# EAGLE design KGM 9DOF v1.0 (EAGLE 5.11)
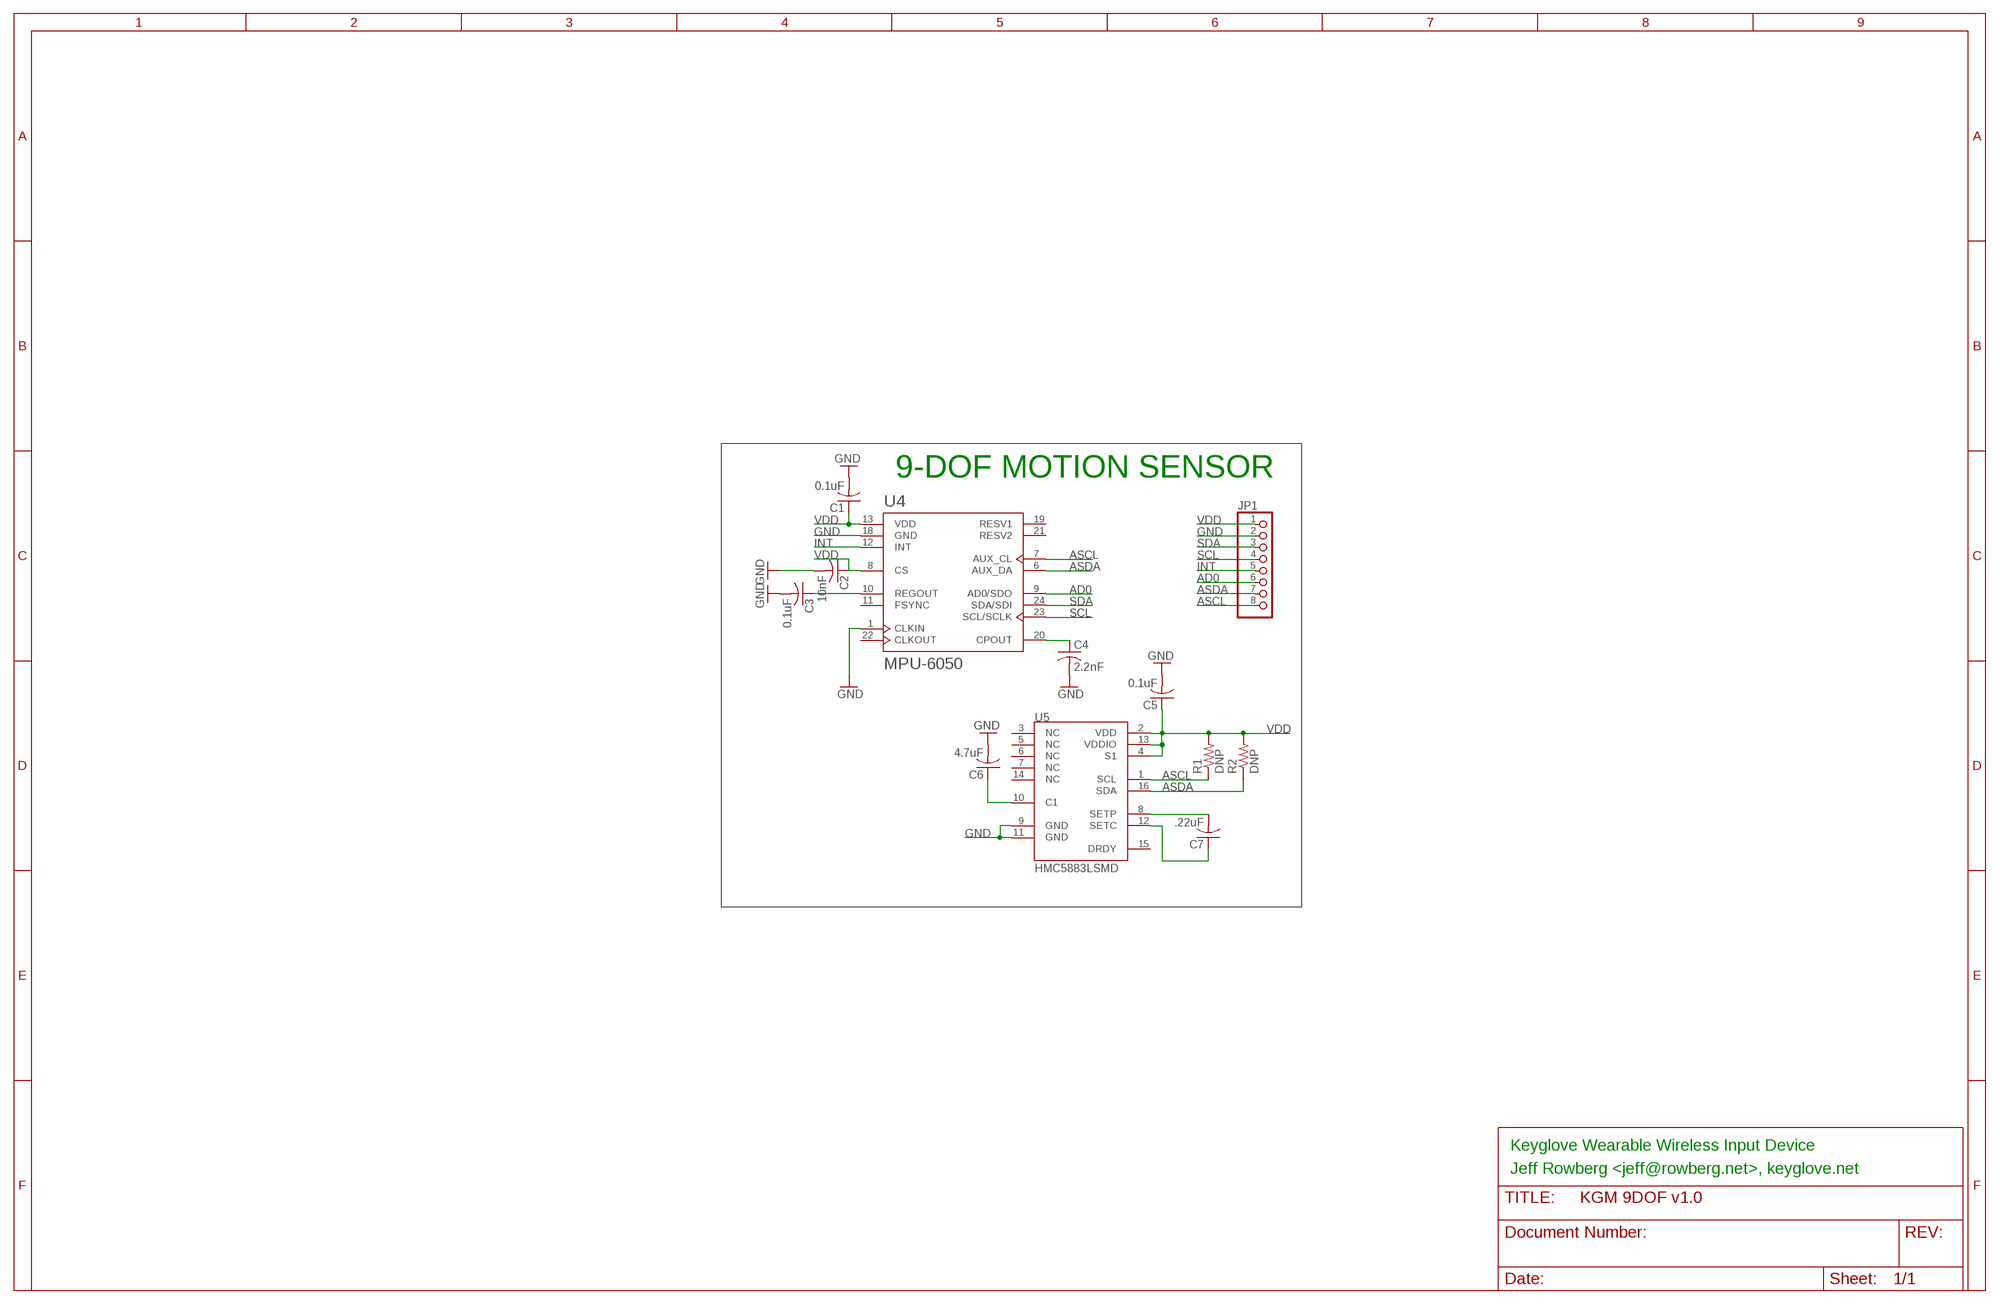
[diagram p0: schematic, sheet 1]

## Parts
C1  0.1uF  C-USC0603  [C0603]
C2  10nF  C-USC0603  [C0603]
C3  0.1uF  C-USC0603  [C0603]
C4  2.2nF  C-USC0603  [C0603]
C5  0.1uF  C-USC0603  [C0603]
C6  4.7uF  C-USC0603  [C0603]
C7  .22uF  C-USC0603  [C0603]
JP1  PINHD-1X8  [1X08]
R1  DNP  R-US_R0603  [R0603]
R2  DNP  R-US_R0603  [R0603]
U4  MPU-6050  MPU-6000  [QFN24MPU]
U5  HMC5883LSMD  [16LPCC]

## Nets
AD0: JP1.6 U4.9(AD0/SDO)
ASCL: JP1.8 R1.1 U4.7(AUX_CL) U5.1(SCL)
ASDA: JP1.7 R2.1 U4.6(AUX_DA) U5.16(SDA)
GND [power]: C1.2 C2.2 C3.2 C4.2 C5.2 C6.2 JP1.2 U4.1(CLKIN) U4.18(GND) U5.9(GND) U5.11(GND)
INT: JP1.5 U4.12(INT)
N$1: C6.1 U5.10(C1)
N$7: C7.2 U5.8(SETP)
N$10: C7.1 U5.12(SETC)
N$16: C4.1 U4.20(CPOUT)
N$17: C3.1 U4.10(REGOUT)
SCL: JP1.4 U4.23(SCL/SCLK)
SDA: JP1.3 U4.24(SDA/SDI)
VDD [power]: C1.1 C2.1 C5.1 JP1.1 R1.2 R2.2 U4.8(CS) U4.13(VDD) U5.2(VDD) U5.4(S1) U5.13(VDDIO)
Unconnected: U4.11(FSYNC) U4.19(RESV1) U4.21(RESV2) U4.22(CLKOUT) U5.3(NC) U5.5(NC) U5.6(NC) U5.7(NC) U5.14(NC) U5.15(DRDY)

## Notes on the sheet
- 9-DOF MOTION SENSOR
- Keyglove Wearable Wireless Input Device
- Jeff Rowberg <jeff@rowberg.net>, keyglove.net

## Library data of the parts
C1-C7 = resistor:C-US: CAPACITOR, American symbol
JP1 = sf-pinhead:PINHD-1X8: PIN HEADER
R1 R2 = resistor:R-US_: RESISTOR, American symbol
U4 = sf-invensense:MPU-6000
U5 = SparkFun:HMC5883L: 3 Axis Digital Compass IC

## Net classes
0 default: width 0.254 mm, drill 0.305 mm, clearance 0.152 mm
1 power: width 0.254 mm, drill 0.305 mm, clearance 0.152 mm

## Board
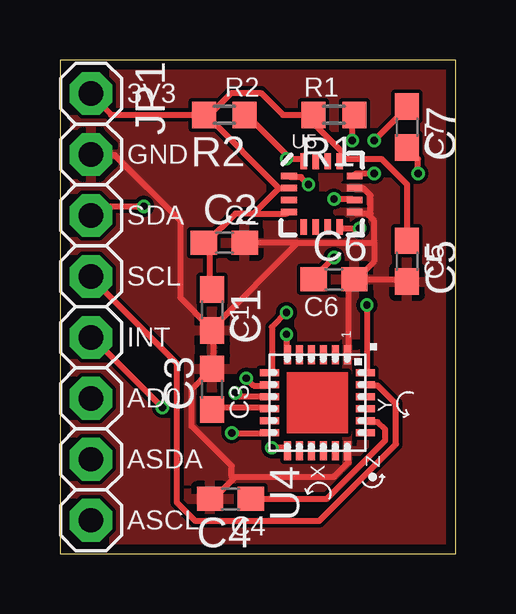
[diagram p1: board, top side]
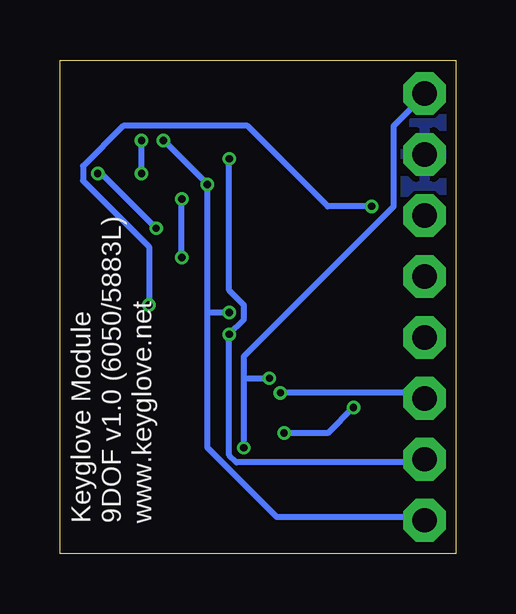
[diagram p2: board, bottom side, seen from below]

Size 16.51 x 20.57 mm. Coordinates in mm from the lower left corner, seen from the top.
Outline: 0,0 16.51,0 16.51,20.57 0,20.57 0,0
Copper layers (1*16): Top 0.0356mm / dielectric 1.5011mm / Bottom 0.0356mm
Design rules "PCBWingOrder *": minimum track width 6mil, minimum drill 12mil, track to track 6mil, track to pad 6mil, pad to pad 6mil, via to via 6mil, smd to smd 6mil, copper to edge 15mil, drill to drill 6mil, minimum pad ring 6mil, minimum via ring 5mil, stop-mask expansion 4mil, vias tented up to drill 20mil, thermal gap 10mil

### Footprints (pad centres in the part's own frame; a part is rotated, then mirrored left to right if it is on the bottom)
C0603 = smd 1.1 x 1: 1 -0.85,0; 2 0.85,0
1X08 = drill 1.016 pad 1.778 octagon: 1 -8.89,0; 2 -6.35,0; 3 -3.81,0; 4 -1.27,0; 5 1.27,0; 6 3.81,0; 7 6.35,0; 8 8.89,0
R0603 = smd 1 x 1.1: 1 -0.85,0; 2 0.85,0
QFN24MPU = smd 0.8 x 0.3: 1 -2,1.25; 2 -2,0.75; 3 -2,0.25; 4 -2,-0.25; 5 -2,-0.75; 6 -2,-1.25; 13 2,-1.25; 14 2,-0.75; 15 2,-0.25; 16 2,0.25; 17 2,0.75; 18 2,1.25 | smd 0.3 x 0.8: 7 -1.25,-2; 8 -0.75,-2; 9 -0.25,-2; 10 0.25,-2; 11 0.75,-2; 12 1.25,-2; 19 1.25,2; 20 0.75,2; 21 0.25,2; 22 -0.25,2; 23 -0.75,2; 24 -1.25,2
16LPCC = smd 0.65 x 0.28: 1 -1.37,0.75; 2 -1.37,0.25; 3 -1.37,-0.25; 4 -1.37,-0.75; 9 1.37,-0.75; 10 1.37,-0.25; 11 1.37,0.25; 12 1.37,0.75 | smd 0.28 x 0.65: 5 -0.75,-1.37; 6 -0.25,-1.37; 7 0.25,-1.37; 8 0.75,-1.37; 13 0.75,1.37; 14 0.25,1.37; 15 -0.25,1.37; 16 -0.75,1.37

### Placement (x,y rotation side)
C1  6.35,10.16 270 top
C2  6.86,12.95 0 top
C3  6.35,6.86 90 top
C4  7.11,2.29 180 top
C5  14.48,12.19 270 top
C6  11.43,11.43 0 top
C7  14.48,17.78 270 top
JP1  1.3,10.29 270 top
R1  11.43,18.29 180 top
R2  6.86,18.29 180 top
U4  10.74,6.29 270 top
U5  10.92,14.99 0 top

### Tracks (layer width: path | path; a pad name or v marks a point on that pad's centre or on a via)
AD0  (via drill 0.3)
  Top 0.254: v7.32,6.71 7.47,6.55 8.69,6.55 U4.9
  Bottom 0.254: v7.32,6.71 1.52,6.71 JP1.6
ASCL  (via drill 0.3)
  Top 0.254: v10.36,15.39 10.06,15.7 9.6,15.7 U5.1 | v9.45,10.06 8.84,9.45 8.84,7.62 U4.7 | v12.19,17.22 12.19,18.29 R1.1
  Bottom 0.254: 10.36,10.06 10.36,4.42 7.47,1.52 1.37,1.52 JP1.8 | 10.36,10.06 v10.36,15.39 v12.19,17.22 | 10.36,10.06 v9.45,10.06
ASDA  (via drill 0.3)
  Top 0.254: 9.53,16.54 7.77,18.29 R2.1 | 9.53,16.54 9.6,16.46 10.06,16.46 U5.16 | v9.45,9.14 9.45,8.38 U4.6 | v9.45,16.46 9.53,16.54
  Bottom 0.254: JP1.7 1.37,3.81 9.14,3.81 9.45,4.12 v9.45,9.14 8.84,9.75 8.84,10.36 9.45,10.97 v9.45,16.46
GND
  Top 0.254: 7.24,3.12 6.4,2.29 C4.2 | 7.24,3.12 7.32,3.2 11.43,3.2 12.04,3.81 12.04,4.27 U4.18 | C1.2 6.4,9.3 6.4,7.77 C3.2 6.25,7.62 5.49,6.86 5.49,5.33 7.16,3.66 7.16,3.2 7.24,3.12 | 12.88,14.1 13.11,13.87 13.11,12.95 | 12.88,14.1 12.8,14.17 12.34,14.17 U5.9 | 13.11,12.95 13.11,12.19 12.34,11.43 C6.2 | U5.11 12.34,15.24 12.65,15.24 12.95,14.94 12.95,14.17 12.88,14.1 | U4.1 12.04,8.38 12.04,11.28 12.19,11.43 C6.2 | 9.91,12.95 13.11,12.95 | 9.91,12.95 C2.2 | C5.2 14.48,11.43 C6.2 | 9.91,12.95 6.4,9.45 C1.2 | JP1.2 1.37,16.61 2.29,16.61 5.03,13.87 5.03,10.67 6.25,9.45 C1.2
  pour Top: 0.25,20.32 16.26,20.32 16.26,0.25 0.25,0.25
  pour Bottom: 0.25,20.32 16.26,20.32 16.26,0.25 0.25,0.25
INT  (via drill 0.3)
  Top 0.254: v7.16,5.03 8.69,5.03 U4.12 | v4.27,6.1 1.37,8.99 JP1.5
  Bottom 0.254: v7.16,5.03 5.33,5.03 v4.27,6.1
N$1  (via drill 0.3)
  Top 0.254: v11.43,14.78 12.19,14.78 U5.10 | v11.43,12.34 10.52,11.43 C6.1
  Bottom 0.254: v11.43,12.34 v11.43,14.78
N$7  (via drill 0.3)
  Top 0.254: v12.5,13.56 11.73,13.56 U5.8 | v14.94,15.85 14.94,16.46 14.48,16.92 C7.2
  Bottom 0.254: v12.5,13.56 14.78,15.85 v14.94,15.85
N$10  (via drill 0.3)
  Top 0.254: v13.11,15.85 12.34,15.85 U5.12 | v13.11,17.22 14.48,18.59 C7.1
  Bottom 0.254: v13.11,15.85 v13.11,17.22
N$16
  Top 0.254: U4.20 12.8,5.49 13.26,5.49 13.56,5.18 13.56,4.72 11.12,2.29 C4.1
N$17
  Top 0.254: U4.10 8.69,6.1 6.4,6.1 C3.1
SCL
  Top 0.254: U4.23 12.8,7.01 13.26,7.01 14.02,6.25 14.02,4.57 10.82,1.37 5.64,1.37 4.88,2.13 4.88,7.92 1.37,11.43 JP1.4
SDA  (via drill 0.3)
  Top 0.254: v12.8,10.36 12.8,7.62 U4.24 | v3.5,14.48 1.68,14.48 JP1.3
  Bottom 0.254: v12.8,10.36 12.8,12.8 15.54,15.54 15.54,16.15 13.87,17.83 8.69,17.83 5.33,14.48 v3.5,14.48
VDD  (via drill 0.3)
  Top 0.254: 11.73,16.46 11.73,16.76 10.67,17.83 10.67,18.29 R1.2 9.3,18.29 8.38,19.2 7.16,19.2 6.25,18.29 R2.2 | 11.73,16.46 13.41,16.46 14.48,15.39 C5.1 | 11.73,16.46 U5.13 | 8.08,14.17 7.32,14.17 6.1,12.95 C2.1 6.25,12.95 6.25,11.12 C1.1 | 8.08,14.17 9.45,14.17 U5.4 | 9.14,15.24 9.45,15.24 U5.2 | 9.14,15.24 8.08,14.17 | 9.14,15.24 6.1,18.29 R2.2 | v8.84,4.42 9.45,4.42 U4.13 | v7.77,7.32 8.08,7.01 8.69,7.01 U4.8 | R2.2 2.13,18.29 1.37,19.05 JP1.1
  Bottom 0.254: 8.84,7.32 8.84,8.23 2.59,14.48 2.59,17.83 1.37,19.05 JP1.1 | v8.84,4.42 8.84,7.32 | 8.84,7.32 v7.77,7.32

### Text on the board
tPlace: 3V3 | R2 | R1 | C7 | GND | SDA | C2 | SCL | C5 | C6 | INT | C1 | AD0 | C3 | ASDA | ASCL | C4
bPlace: www.keyglove.net | 9DOF v1.0 (6050/5883L) | Keyglove Module